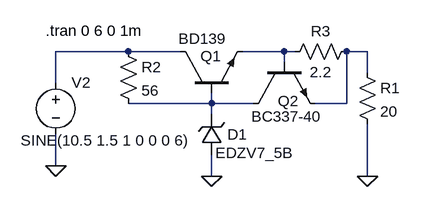
[diagram p0: schematic fuebte.asc]
fuebte.asc, the LTspice schematic file:
Version 4
SHEET 1 880 680
WIRE -64 16 -176 16
WIRE 16 16 -64 16
WIRE 176 16 112 16
WIRE 192 16 176 16
WIRE 304 16 272 16
WIRE 176 32 176 16
WIRE 304 48 304 16
WIRE -176 64 -176 16
WIRE 64 96 64 80
WIRE 64 96 -64 96
WIRE 128 96 64 96
WIRE 272 96 272 16
WIRE 272 96 224 96
WIRE 64 112 64 96
WIRE -176 192 -176 144
WIRE 64 208 64 176
WIRE 304 208 304 128
FLAG 64 208 0
FLAG 304 208 0
FLAG -176 192 0
SYMBOL npn 16 80 R270
WINDOW 0 57 31 VRight 2
WINDOW 3 84 -3 VRight 2
SYMATTR InstName Q1
SYMATTR Value BD139
SYMBOL zener 80 176 R180
WINDOW 0 -39 32 Left 2
WINDOW 3 -110 4 Left 2
SYMATTR InstName D1
SYMATTR Value EDZV7_5B
SYMBOL res 288 32 R0
SYMATTR InstName R1
SYMATTR Value 20
SYMBOL res -80 0 R0
SYMATTR InstName R2
SYMATTR Value 56
SYMBOL voltage -176 48 R0
WINDOW 3 -54 105 Left 2
WINDOW 123 0 0 Left 0
WINDOW 39 0 0 Left 0
SYMATTR Value SINE(10.5 1.5 1 0 0 0 6)
SYMATTR InstName V2
SYMBOL npn 128 32 M90
WINDOW 0 60 38 VRight 2
WINDOW 3 84 -3 VRight 2
SYMATTR InstName Q2
SYMATTR Value BC337-40
SYMBOL res 288 0 R90
WINDOW 0 0 56 VBottom 2
WINDOW 3 32 56 VTop 2
SYMATTR InstName R3
SYMATTR Value 2.2
TEXT -192 -16 Left 2 !.tran 0 6 0 1m

The netlist it stands for:
* fuebte.asc
Q1 N001 N004 N002 0 BD139
D1 0 N004 EDZV7_5B
R1 N003 0 20
R2 N001 N004 56
V2 N001 0 SINE(10.5 1.5 1 0 0 0 6)
Q2 N004 N002 N003 0 BC337-40
R3 N003 N002 2.2
.model D D
.lib standard.dio
.model NPN NPN
.model PNP PNP
.lib standard.bjt
.tran 0 6 0 1m
.backanno
.end